# Altium schematic sheet DDR3L.SchDoc
size D; DocumentNumber: 4; SheetNumber: 4; SheetTotal: 13
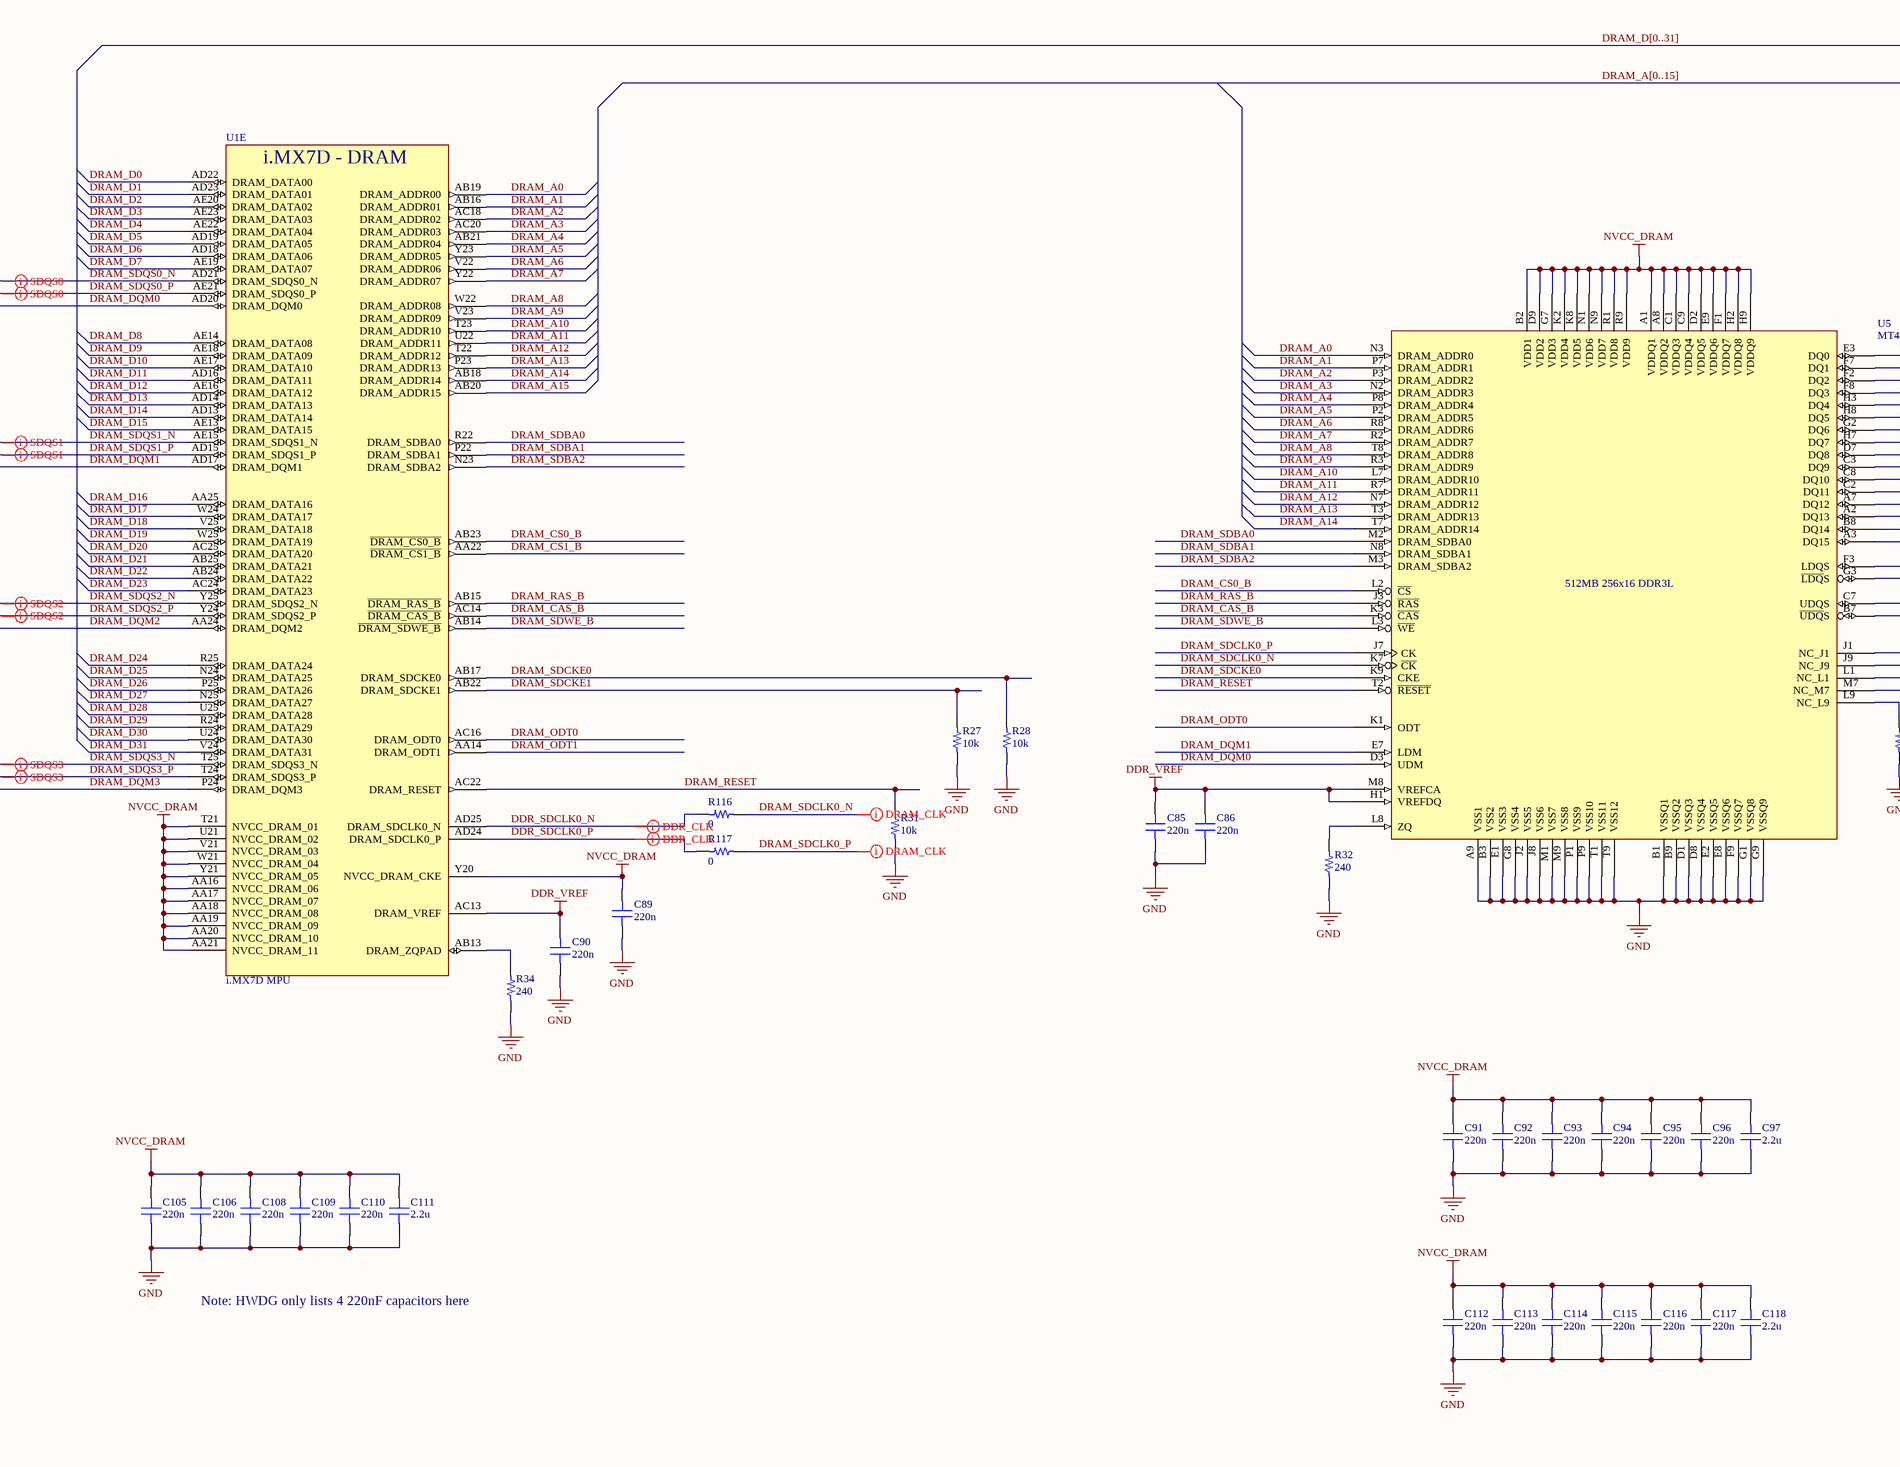
[diagram p0: DDR3L.SchDoc, left]
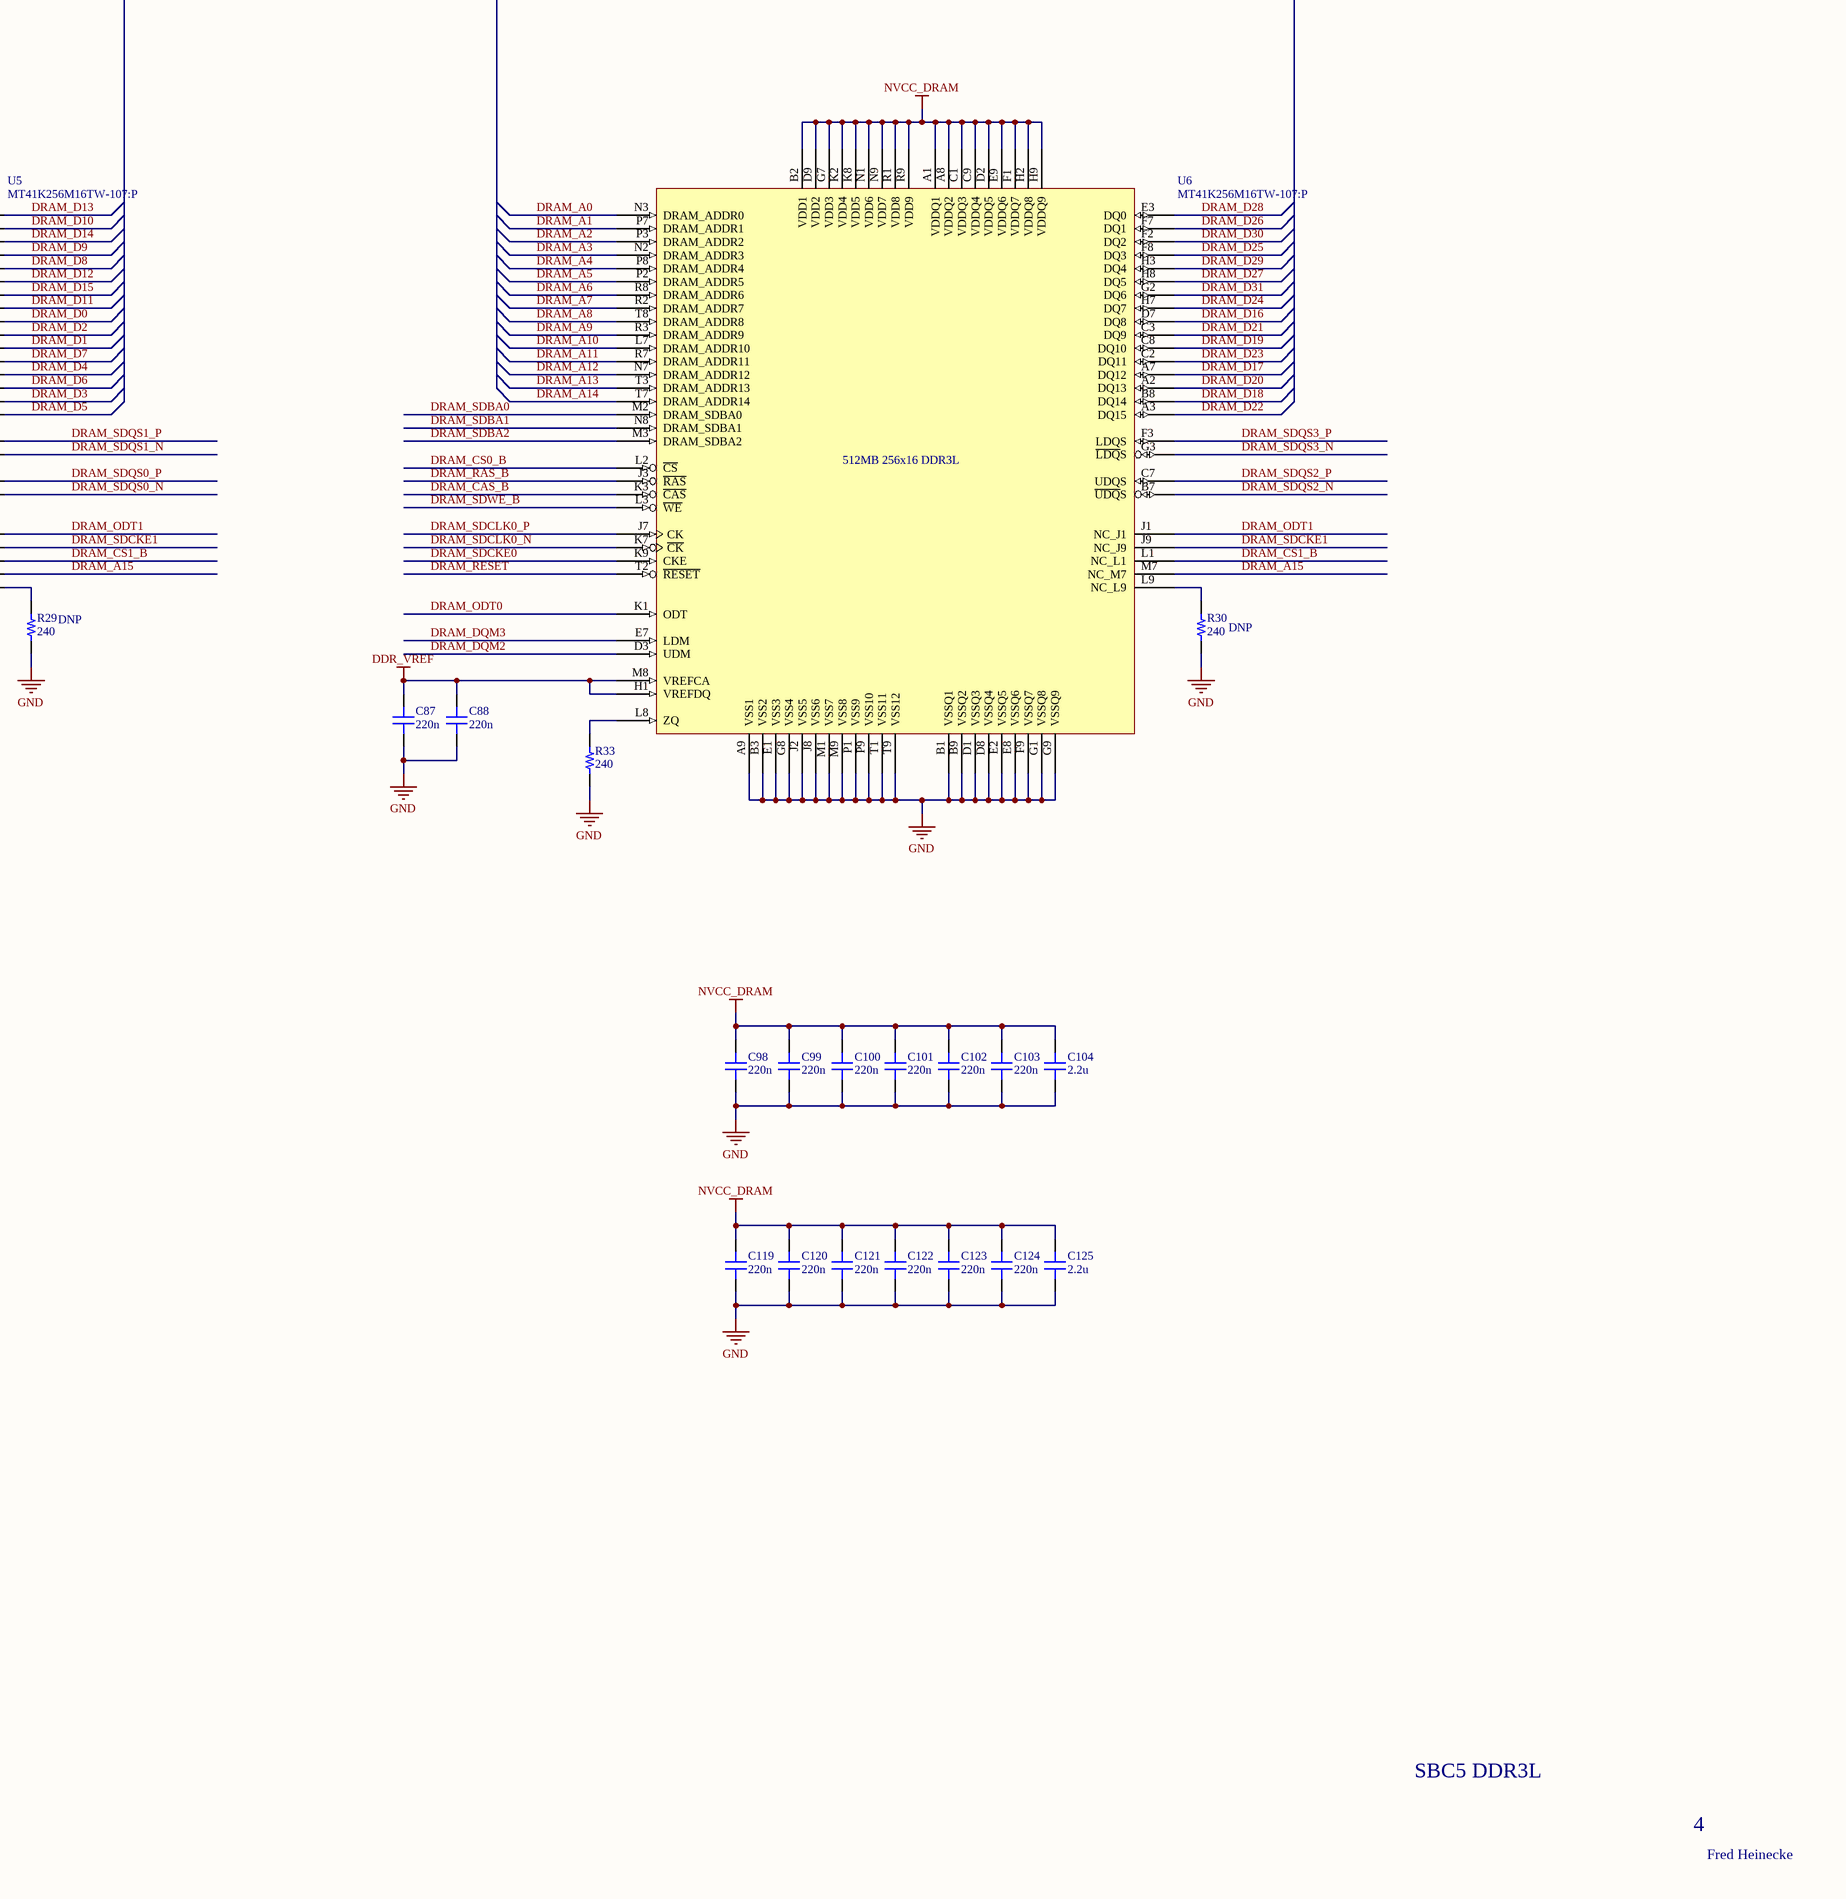
[diagram p1: DDR3L.SchDoc, right]

## Parts
C85  220n  [C0201]
C86  220n  [C0201]
C87  220n  [C0201]
C88  220n  [C0201]
C89  220n  [C0201]
C90  220n  [C0201]
C91  220n  [C0201]
C92  220n  [C0201]
C93  220n  [C0201]
C94  220n  [C0201]
C95  220n  [C0201]
C96  220n  [C0201]
C97  2.2u  [C0402]
C98  220n  [C0201]
C99  220n  [C0201]
C100  220n  [C0201]
C101  220n  [C0201]
C102  220n  [C0201]
C103  220n  [C0201]
C104  2.2u  [C0402]
C105  220n  [C0201]
C106  220n  [C0201]
C108  220n  [C0201]
C109  220n  [C0201]
C110  220n  [C0201]
C111  2.2u  [C0402]
C112  220n  [C0201]
C113  220n  [C0201]
C114  220n  [C0201]
C115  220n  [C0201]
C116  220n  [C0201]
C117  220n  [C0201]
C118  2.2u  [C0402]
C119  220n  [C0201]
C120  220n  [C0201]
C121  220n  [C0201]
C122  220n  [C0201]
C123  220n  [C0201]
C124  220n  [C0201]
C125  2.2u  [C0402]
R27  10k  [R0201]
R28  10k  [R0201]
R29  240  [R0201]
R30  240  [R0201]
R31  10k  [R0201]
R32  240  [R0201]
R33  240  [R0201]
R34  240  [R0201]
R116  0  [R0201]
R117  0  [R0201]
U1  i.MX7D MPU  [BGA541C75P25X25_1900X1900X140]  (part E of 23)
U5  MT41K256M16TW-107:P  [96xBGA DDR3L]
U6  MT41K256M16TW-107:P  [96xBGA DDR3L]

## Nets
DDR_VREF: C85.2 C86.2 C87.2 C88.2 C90.2 U1.AC13(DRAM_VREF) U5.H1(VREFDQ) U5.M8(VREFCA) U6.H1(VREFDQ) U6.M8(VREFCA)
GND: C85.1 C86.1 C87.1 C88.1 C89.1 C90.1 C91.1 C92.1 C93.1 C94.1 C95.1 C96.1 C97.1 C98.1 C99.1 C100.1 C101.1 C102.1 C103.1 C104.1 C105.1 C106.1 C108.1 C109.1 C110.1 C111.1 C112.1 C113.1 C114.1 C115.1 C116.1 C117.1 C118.1 C119.1 C120.1 C121.1 C122.1 C123.1 C124.1 C125.1 R27.1 R28.1 R29.1 R30.1 R31.1 R32.1 R33.1 R34.1 U5.A9(VSS1) U5.B1(VSSQ1) U5.B3(VSS2) U5.B9(VSSQ2) U5.D1(VSSQ3) U5.D8(VSSQ4) U5.E1(VSS3) U5.E2(VSSQ5) U5.E8(VSSQ6) U5.F9(VSSQ7) U5.G1(VSSQ8) U5.G8(VSS4) U5.G9(VSSQ9) U5.J2(VSS5) U5.J8(VSS6) U5.M1(VSS7) U5.M9(VSS8) U5.P1(VSS9) U5.P9(VSS10) U5.T1(VSS11) U5.T9(VSS12) U6.A9(VSS1) U6.B1(VSSQ1) U6.B3(VSS2) U6.B9(VSSQ2) U6.D1(VSSQ3) U6.D8(VSSQ4) U6.E1(VSS3) U6.E2(VSSQ5) U6.E8(VSSQ6) U6.F9(VSSQ7) U6.G1(VSSQ8) U6.G8(VSS4) U6.G9(VSSQ9) U6.J2(VSS5) U6.J8(VSS6) U6.M1(VSS7) U6.M9(VSS8) U6.P1(VSS9) U6.P9(VSS10) U6.T1(VSS11) U6.T9(VSS12)
NVCC_DRAM: C89.2 C91.2 C92.2 C93.2 C94.2 C95.2 C96.2 C97.2 C98.2 C99.2 C100.2 C101.2 C102.2 C103.2 C104.2 C105.2 C106.2 C108.2 C109.2 C110.2 C111.2 C112.2 C113.2 C114.2 C115.2 C116.2 C117.2 C118.2 C119.2 C120.2 C121.2 C122.2 C123.2 C124.2 C125.2 U1.AA16(NVCC_DRAM_06) U1.AA17(NVCC_DRAM_07) U1.AA18(NVCC_DRAM_08) U1.AA19(NVCC_DRAM_09) U1.AA20(NVCC_DRAM_10) U1.AA21(NVCC_DRAM_11) U1.T21(NVCC_DRAM_01) U1.U21(NVCC_DRAM_02) U1.V21(NVCC_DRAM_03) U1.W21(NVCC_DRAM_04) U1.Y20(NVCC_DRAM_CKE) U1.Y21(NVCC_DRAM_05) U5.A1(VDDQ1) U5.A8(VDDQ2) U5.B2(VDD1) U5.C1(VDDQ3) U5.C9(VDDQ4) U5.D2(VDDQ5) U5.D9(VDD2) U5.E9(VDDQ6) U5.F1(VDDQ7) U5.G7(VDD3) U5.H2(VDDQ8) U5.H9(VDDQ9) U5.K2(VDD4) U5.K8(VDD5) U5.N1(VDD6) U5.N9(VDD7) U5.R1(VDD8) U5.R9(VDD9) U6.A1(VDDQ1) U6.A8(VDDQ2) U6.B2(VDD1) U6.C1(VDDQ3) U6.C9(VDDQ4) U6.D2(VDDQ5) U6.D9(VDD2) U6.E9(VDDQ6) U6.F1(VDDQ7) U6.G7(VDD3) U6.H2(VDDQ8) U6.H9(VDDQ9) U6.K2(VDD4) U6.K8(VDD5) U6.N1(VDD6) U6.N9(VDD7) U6.R1(VDD8) U6.R9(VDD9)
DDR_SDCLK0_N: R116.1 U1.AD25(DRAM_SDCLK0_N)
DDR_SDCLK0_P: R117.1 U1.AD24(DRAM_SDCLK0_P)
DRAM_A0: U1.AB19(DRAM_ADDR00) U5.N3(DRAM_ADDR0) U6.N3(DRAM_ADDR0)
DRAM_A1: U1.AB16(DRAM_ADDR01) U5.P7(DRAM_ADDR1) U6.P7(DRAM_ADDR1)
DRAM_A2: U1.AC18(DRAM_ADDR02) U5.P3(DRAM_ADDR2) U6.P3(DRAM_ADDR2)
DRAM_A3: U1.AC20(DRAM_ADDR03) U5.N2(DRAM_ADDR3) U6.N2(DRAM_ADDR3)
DRAM_A4: U1.AB21(DRAM_ADDR04) U5.P8(DRAM_ADDR4) U6.P8(DRAM_ADDR4)
DRAM_A5: U1.Y23(DRAM_ADDR05) U5.P2(DRAM_ADDR5) U6.P2(DRAM_ADDR5)
DRAM_A6: U1.V22(DRAM_ADDR06) U5.R8(DRAM_ADDR6) U6.R8(DRAM_ADDR6)
DRAM_A7: U1.Y22(DRAM_ADDR07) U5.R2(DRAM_ADDR7) U6.R2(DRAM_ADDR7)
DRAM_A8: U1.W22(DRAM_ADDR08) U5.T8(DRAM_ADDR8) U6.T8(DRAM_ADDR8)
DRAM_A9: U1.V23(DRAM_ADDR09) U5.R3(DRAM_ADDR9) U6.R3(DRAM_ADDR9)
DRAM_A10: U1.T23(DRAM_ADDR10) U5.L7(DRAM_ADDR10) U6.L7(DRAM_ADDR10)
DRAM_A11: U1.U22(DRAM_ADDR11) U5.R7(DRAM_ADDR11) U6.R7(DRAM_ADDR11)
DRAM_A12: U1.T22(DRAM_ADDR12) U5.N7(DRAM_ADDR12) U6.N7(DRAM_ADDR12)
DRAM_A13: U1.P23(DRAM_ADDR13) U5.T3(DRAM_ADDR13) U6.T3(DRAM_ADDR13)
DRAM_A14: U1.AB18(DRAM_ADDR14) U5.T7(DRAM_ADDR14) U6.T7(DRAM_ADDR14)
DRAM_A15: U1.AB20(DRAM_ADDR15) U5.M7(NC_M7) U6.M7(NC_M7)
DRAM_CAS_B: U1.AC14(~{DRAM_CAS_B}) U5.K3(~{CAS}) U6.K3(~{CAS})
DRAM_CS0_B: U1.AB23(~{DRAM_CS0_B}) U5.L2(~{CS}) U6.L2(~{CS})
DRAM_CS1_B: U1.AA22(~{DRAM_CS1_B}) U5.L1(NC_L1) U6.L1(NC_L1)
DRAM_D0: U1.AD22(DRAM_DATA00) U5.D7(DQ8)
DRAM_D1: U1.AD23(DRAM_DATA01) U5.C8(DQ10)
DRAM_D2: U1.AE20(DRAM_DATA02) U5.C3(DQ9)
DRAM_D3: U1.AE23(DRAM_DATA03) U5.B8(DQ14)
DRAM_D4: U1.AE22(DRAM_DATA04) U5.A7(DQ12)
DRAM_D5: U1.AD19(DRAM_DATA05) U5.A3(DQ15)
DRAM_D6: U1.AD18(DRAM_DATA06) U5.A2(DQ13)
DRAM_D7: U1.AE19(DRAM_DATA07) U5.C2(DQ11)
DRAM_D8: U1.AE14(DRAM_DATA08) U5.H3(DQ4)
DRAM_D9: U1.AE18(DRAM_DATA09) U5.F8(DQ3)
DRAM_D10: U1.AE17(DRAM_DATA10) U5.F7(DQ1)
DRAM_D11: U1.AD16(DRAM_DATA11) U5.H7(DQ7)
DRAM_D12: U1.AE16(DRAM_DATA12) U5.H8(DQ5)
DRAM_D13: U1.AD14(DRAM_DATA13) U5.E3(DQ0)
DRAM_D14: U1.AD13(DRAM_DATA14) U5.F2(DQ2)
DRAM_D15: U1.AE13(DRAM_DATA15) U5.G2(DQ6)
DRAM_D16: U1.AA25(DRAM_DATA16) U6.D7(DQ8)
DRAM_D17: U1.W24(DRAM_DATA17) U6.A7(DQ12)
DRAM_D18: U1.V25(DRAM_DATA18) U6.B8(DQ14)
DRAM_D19: U1.W25(DRAM_DATA19) U6.C8(DQ10)
DRAM_D20: U1.AC25(DRAM_DATA20) U6.A2(DQ13)
DRAM_D21: U1.AB25(DRAM_DATA21) U6.C3(DQ9)
DRAM_D22: U1.AB24(DRAM_DATA22) U6.A3(DQ15)
DRAM_D23: U1.AC24(DRAM_DATA23) U6.C2(DQ11)
DRAM_D24: U1.R25(DRAM_DATA24) U6.H7(DQ7)
DRAM_D25: U1.N24(DRAM_DATA25) U6.F8(DQ3)
DRAM_D26: U1.P25(DRAM_DATA26) U6.F7(DQ1)
DRAM_D27: U1.N25(DRAM_DATA27) U6.H8(DQ5)
DRAM_D28: U1.U25(DRAM_DATA28) U6.E3(DQ0)
DRAM_D29: U1.R24(DRAM_DATA29) U6.H3(DQ4)
DRAM_D30: U1.U24(DRAM_DATA30) U6.F2(DQ2)
DRAM_D31: U1.V24(DRAM_DATA31) U6.G2(DQ6)
DRAM_DQM0: U1.AD20(DRAM_DQM0) U5.D3(UDM)
DRAM_DQM1: U1.AD17(DRAM_DQM1) U5.E7(LDM)
DRAM_DQM2: U1.AA24(DRAM_DQM2) U6.D3(UDM)
DRAM_DQM3: U1.P24(DRAM_DQM3) U6.E7(LDM)
DRAM_ODT0: U1.AC16(DRAM_ODT0) U5.K1(ODT) U6.K1(ODT)
DRAM_ODT1: U1.AA14(DRAM_ODT1) U5.J1(NC_J1) U6.J1(NC_J1)
DRAM_RAS_B: U1.AB15(~{DRAM_RAS_B}) U5.J3(~{RAS}) U6.J3(~{RAS})
DRAM_RESET: R31.2 U1.AC22(DRAM_RESET) U5.T2(~{RESET}) U6.T2(~{RESET})
DRAM_SDBA0: U1.R22(DRAM_SDBA0) U5.M2(DRAM_SDBA0) U6.M2(DRAM_SDBA0)
DRAM_SDBA1: U1.P22(DRAM_SDBA1) U5.N8(DRAM_SDBA1) U6.N8(DRAM_SDBA1)
DRAM_SDBA2: U1.N23(DRAM_SDBA2) U5.M3(DRAM_SDBA2) U6.M3(DRAM_SDBA2)
DRAM_SDCKE0: R28.2 U1.AB17(DRAM_SDCKE0) U5.K9(CKE) U6.K9(CKE)
DRAM_SDCKE1: R27.2 U1.AB22(DRAM_SDCKE1) U5.J9(NC_J9) U6.J9(NC_J9)
DRAM_SDCLK0_N: R116.2 U5.K7(~{CK}) U6.K7(~{CK})
DRAM_SDCLK0_P: R117.2 U5.J7(CK) U6.J7(CK)
DRAM_SDQS0_N: U1.AD21(DRAM_SDQS0_N) U5.B7(~{UDQ}S)
DRAM_SDQS0_P: U1.AE21(DRAM_SDQS0_P) U5.C7(UDQS)
DRAM_SDQS1_N: U1.AE15(DRAM_SDQS1_N) U5.G3(~{LDQ}S)
DRAM_SDQS1_P: U1.AD15(DRAM_SDQS1_P) U5.F3(LDQS)
DRAM_SDQS2_N: U1.Y25(DRAM_SDQS2_N) U6.B7(~{UDQ}S)
DRAM_SDQS2_P: U1.Y24(DRAM_SDQS2_P) U6.C7(UDQS)
DRAM_SDQS3_N: U1.T25(DRAM_SDQS3_N) U6.G3(~{LDQ}S)
DRAM_SDQS3_P: U1.T24(DRAM_SDQS3_P) U6.F3(LDQS)
DRAM_SDWE_B: U1.AB14(~{DRAM_SDWE_B}) U5.L3(~{WE}) U6.L3(~{WE})
NetR29_2: R29.2 U5.L9(NC_L9)
NetR30_2: R30.2 U6.L9(NC_L9)
NetR32_2: R32.2 U5.L8(ZQ)
NetR33_2: R33.2 U6.L8(ZQ)
NetR34_2: R34.2 U1.AB13(DRAM_ZQPAD)

## Buses and harness runs
bus DRAM_A[0..15]
bus DRAM_D[0..31]

## Layout directives
differential pair: DDR_SDCLK0_N, DDR_SDCLK0_P, DRAM_SDCLK0_N, DRAM_SDCLK0_P, DRAM_SDQS0_N, DRAM_SDQS0_P, DRAM_SDQS1_N, DRAM_SDQS1_P, DRAM_SDQS2_N, DRAM_SDQS2_P, DRAM_SDQS3_N, DRAM_SDQS3_P

## Notes on the sheet
- (near R29) DNP
- (near R30) DNP
- Note: HWDG only lists 4 220nF capacitors here
- SBC5 DDR3L
- 4
- Fred Heinecke
- (in symbol MCIMX7D2DVM12SD, part E) i.MX7D - DRAM
- (in symbol MT41K256M16TW-107:P) 512MB 256x16 DDR3L

## Library data of the parts
C85-C96 C98-C103 C105 C106 C108-C110 C112-C117 C119-C124 = GRM033R61C224KE14D: Cap Ceramic Monolithic 0.22uF 16VDC 10% SMD Paper T/R; Manufacturer: Murata; Supplier 1: Digi-Key; Manufacturer Part Number: GRM033R61C224KE14D; RoHS: No; Stock 1: 16192; Pricing 1: 1=0.10000, 10=0.03900, 50=0.02120, 100=0.01720, 500=0.01232, 1000=0.00968, 2500=0.00880, 5000=0.00810 (USD); ComponentLink1URL: https://search.murata.co.jp/Ceramy/image/img/A01X/G101/ENG/GRM033R61C224KE14-01.pdf?src-supplier=Digi-Key; ComponentLink1Description: https://search.murata.co.jp/Ceramy/image/img/A01X/G101/ENG/GRM033R61C224KE14-01.pdf?src-supplier=Digi-Key; Supplier Part Number 1: 490-17040-1-ND
C97 C104 C111 C118 C125 = LMK105BJ225MV-F: TAIYO YUDEN         LMK105BJ225MV-F            CERAMIC CAPACITOR, 2.2UF, 10V, X5R, 20%, 0402; Supplier 1: Digi-Key; Manufacturer: Taiyo Yuden; Manufacturer Part Number: LMK105BJ225MV-F; RoHS: Yes; Category: Ceramic Capacitors; Stock 1: 422093; Pricing 1: 1=0.10000, 10=0.05800, 50=0.03160, 100=0.02590, 500=0.01848, 1000=0.01452, 2500=0.01320, 5000=0.01214 (USD); Mount: Surface Mount; Case/Package: 0402; Case Code (Imperial): 0402; Case Code (Metric): 1005; Min Operating Temperature: -55°C; Max Operating Temperature: 85°C; Termination: SMD/SMT; Packaging: Tape and Reel; Capacitance: 2.2uF; Tolerance: 20%; Voltage Rating: 10V; Package Quantity: 1; Voltage Rating (DC): 10V; Dielectric: X5R; Resistor Type: Ceramic; Length: 1mm; Width: 0.5mm; Height: 0.5mm; Thickness: 0.022inch; Depth: 0.5mm; Radiation Hardening: No; Halogen Free: Halogen Free; REACH SVHC: Unknown; ComponentLink1URL: https://datasheet.ciiva.com/30190/500lmk105bj225mv-f-30190498.pdf?src-supplier=Onlinecomponents.com; ComponentLink1Description: https://datasheet.ciiva.com/30190/500lmk105bj225mv-f-30190498.pdf?src-supplier=Onlinecomponents.com; ComponentLink2URL: https://datasheet.ciiva.com/23631/lmk105bj225mv-f-ss-23631491.pdf?src-supplier=Newark; ComponentLink2Description: https://datasheet.ciiva.com/23631/lmk105bj225mv-f-ss-23631491.pdf?src-supplier=Newark; ComponentLink3URL: https://datasheet.ciiva.com/134/lmk105bj225mv-f-ss-134677.pdf?src-supplier=Digi-Key; ComponentLink3Description: https://datasheet.ciiva.com/134/lmk105bj225mv-f-ss-134677.pdf?src-supplier=Digi-Key; ComponentLink4URL: https://datasheet.ciiva.com/15921/286lmk105bj225mv-f-15921222.pdf?src-supplier=Onlinecomponents.com; ComponentLink4Description: https://datasheet.ciiva.com/15921/286lmk105bj225mv-f-15921222.pdf?src-supplier=Onlinecomponents.com; Supplier Part Number 1: 587-3153-1-ND
R27 R28 R31 = RMCF0201FT10K0: RES 10K OHM 1% 1/20W 0201; Manufacturer: Stackpole Electronics; Max Power Dissipation: 50mW; Temperature Coefficient: 200ppm/°C; Resistance: 10kR; Supplier 1: Digi-Key; Manufacturer Part Number: RMCF0201FT10K0; RoHS: Yes; Category: Chip SMD Resistors; Stock 1: 1526173; Pricing 1: 1=0.10000, 10=0.02300, 100=0.00940, 1000=0.00424, 2500=0.00368, 5000=0.00304 (USD); Mount: Surface Mount; Case/Package: 0201; Contact Plating: Tin,Matte; Case Code (Imperial): 0201; Case Code (Metric): 0603; Min Operating Temperature: -55°C; Max Operating Temperature: 125°C; Resistor Type: Thick Film; Number of Terminations: 2; Packaging: Tape and Reel; Tolerance: 1%; Power Rating: 50mW; Length: 0.024inch; Width: 0.012inch; Height: 0.009inch; ComponentLink1URL: https://www.seielect.com/catalog/SEI-Packaging.pdf?src-supplier=Digi-Key; ComponentLink1Description: https://www.seielect.com/catalog/SEI-Packaging.pdf?src-supplier=Digi-Key; ComponentLink2URL: https://www.seielect.com/Catalog/SEI-RMCF_RMCP.pdf?src-supplier=Avnet+Asia; ComponentLink2Description: https://www.seielect.com/Catalog/SEI-RMCF_RMCP.pdf?src-supplier=Avnet+Asia; ComponentLink3URL: https://www.seielect.com/Catalog/SEI-RMCF_RMCP.pdf?src-supplier=Avnet; ComponentLink3Description: https://www.seielect.com/Catalog/SEI-RMCF_RMCP.pdf?src-supplier=Avnet; ComponentLink4URL: https://www.seielect.com/Catalog/SEI-RMCF_RMCP.pdf?src-supplier=Digi-Key; ComponentLink4Description: https://www.seielect.com/Catalog/SEI-RMCF_RMCP.pdf?src-supplier=Digi-Key; Supplier Part Number 1: RMCF0201FT10K0CT-ND
R29 R30 R32-R34 = RMCF0201FG240R: RES 240 OHM 1% 1/20W 0201; Manufacturer: Stackpole Electronics; Max Power Dissipation: 50mW; Temperature Coefficient: 200ppm/°C; Resistance: 240R; Supplier 1: Digi-Key; Manufacturer Part Number: RMCF0201FG240R; RoHS: Yes; Category: Chip SMD Resistors; Stock 1: 229468; Pricing 1: 1=0.10000, 10=0.02300, 100=0.00940, 1000=0.00424, 2500=0.00368, 5000=0.00304 (USD); Case/Package: 0201; Case Code (Imperial): 0201; Case Code (Metric): 0603; Min Operating Temperature: -55°C; Max Operating Temperature: 125°C; Tolerance: 1%; Packaging: Tape and Reel; Resistor Type: Thick Film; Number of Terminations: 2; Length: 0.024inch; Width: 0.012inch; Height: 0.009inch; ComponentLink1URL: https://www.seielect.com/Catalog/SEI-RMCF_RMCP.pdf?src-supplier=Digi-Key; ComponentLink1Description: https://www.seielect.com/Catalog/SEI-RMCF_RMCP.pdf?src-supplier=Digi-Key; ComponentLink2URL: https://www.seielect.com/catalog/SEI-Packaging.pdf?src-supplier=Digi-Key; ComponentLink2Description: https://www.seielect.com/catalog/SEI-Packaging.pdf?src-supplier=Digi-Key; Supplier Part Number 1: RMCF0201FG240RCT-ND
R116 R117 = ERJ-1GN0R00C: ERJ Series 0201 0 Ohm 0.05 W Jumper Surface Mount Thick Film Chip Resistor; Manufacturer: Panasonic; Resistance: 0R; Power Rating: 50mW; Tolerance: 1%; Voltage Rating: 25V; Temperature Coefficient: 600ppm/°C; Supplier 1: Digi-Key; Supplier Part Number 1: P15979CT-ND; Manufacturer Part Number: ERJ-1GN0R00C; RoHS: Yes; Category: Chip SMD Resistors; Stock 1: 2368857; Pricing 1: 1=0.10000, 10=0.02500, 25=0.01800, 50=0.01360, 100=0.01000, 250=0.00764, 500=0.00612, 1000=0.00450, 5000=0.00323 (USD); Mount: Surface Mount; Case/Package: 0201; Case Code (Imperial): 0201; Case Code (Metric): 0603; Contact Plating: Tin; Min Operating Temperature: -55°C; Max Operating Temperature: 125°C; Packaging: Tape and Reel; Package Quantity: 15000; Resistor Type: Thick Film; Voltage Rating (DC): 25V; Features: Automotive AEC-Q200; Series: ERJ; Max Power Dissipation: 50mW; Number of Terminations: 2; Construction: Rectangular; Length: 0.6mm; Width: 0.3mm; Height: 0.23mm; Depth: 0.3mm; REACH SVHC: Unknown; Military Standard: Not; Lead Free: Lead Free; RoHS Compliant: Yes; ComponentLink1URL: https://datasheet.ciiva.com/22730/1678796-22730749.pdf?src-supplier=Element14; ComponentLink1Description: https://datasheet.ciiva.com/22730/1678796-22730749.pdf?src-supplier=Element14
U1 = MCIMX7D2DVM12SD: Heterogeneous Multicore Processing Architecture; Manufacturer: NXP Freescale; Manufacturer Part Number: MCIMX7D2DVM12SD; Stock 1: 0; Pricing 1: 168=18.42238 (USD); ComponentLink1Description: Datasheet; ComponentLink1URL: https://www.nxp.com/docs/en/data-sheet/IMX7DCEC.pdf; ComponentLink2Description: Reference manual; ComponentLink2URL: https://www.nxp.com/docs/en/reference-manual/IMX7DRM.pdf; ComponentLink3Description: Hardware Development Guide; ComponentLink3URL: https://www.nxp.com/docs/en/user-guide/IMX7DSHDG.pdf; Supplier 1: Digi-Key; Supplier Part Number 1: 568-15401-ND
U5 U6 = MT41K256M16TW-107:P: DRAM Chip DDR3L SDRAM 4G-Bit 256Mx16 1.35V 96 FBGA; Manufacturer: Micron Technology; Memory Type: RAM,SDRAM; Frequency: 933MHz; Access Time: 20ns; Interface: Parallel; Density: 4Gb; Address Bus Width: 15b; Data Bus Width: 16b; Supplier 1: Digi-Key; Manufacturer Part Number: MT41K256M16TW-107:P; RoHS: Yes; Category: RAM; Stock 1: 9431; Pricing 1: 1=4.98000, 10=4.51500, 25=4.41680, 40=4.39275, 80=3.93875, 230=3.92439, 440=3.78098, 1224=3.59456, 6120=3.19782 (USD); Mount: Surface Mount; Case/Package: FBGA; Contact Plating: Copper,Tin,Silver; Min Operating Temperature: 0°C; Max Operating Temperature: 95°C; Max Frequency: 933MHz; Operating Supply Voltage: 1.35V; ComponentLink1URL: http://www.farnell.com/datasheets/2712419.pdf?src-supplier=Farnell; ComponentLink1Description: http://www.farnell.com/datasheets/2712419.pdf?src-supplier=Farnell; ComponentLink2URL: https://www.micron.com/~/media/documents/products/data-sheet/dram/ddr3/4gb_ddr3l.pdf?src-supplier=Avnet+Asia; ComponentLink2Description: https://www.micron.com/~/media/documents/products/data-sheet/dram/ddr3/4gb_ddr3l.pdf?src-supplier=Avnet+Asia; ComponentLink3URL: https://www.micron.com/~/media/documents/products/data-sheet/dram/ddr3/4gb_ddr3l.pdf?src-supplier=Digi-Key; ComponentLink3Description: https://www.micron.com/~/media/documents/products/data-sheet/dram/ddr3/4gb_ddr3l.pdf?src-supplier=Digi-Key; ComponentLink4URL: http://www.farnell.com/datasheets/2712419.pdf?src-supplier=Newark; ComponentLink4Description: http://www.farnell.com/datasheets/2712419.pdf?src-supplier=Newark; ComponentLink5URL: https://www.micron.com/~/media/documents/products/data-sheet/dram/ddr3/4gb_ddr3l.pdf?src-supplier=Avnet; ComponentLink5Description: https://www.micron.com/~/media/documents/products/data-sheet/dram/ddr3/4gb_ddr3l.pdf?src-supplier=Avnet; Supplier Part Number 1: 557-1792-ND; Supplier 2: Newark; Supplier Part Number 2: 80AH8029; Supplier 3: Mouser; Supplier Part Number 3: 340-265846-TRAY